# EAGLE design Gradiometric sensor (EAGLE 8.1.0)

## Sheet 1 of 2
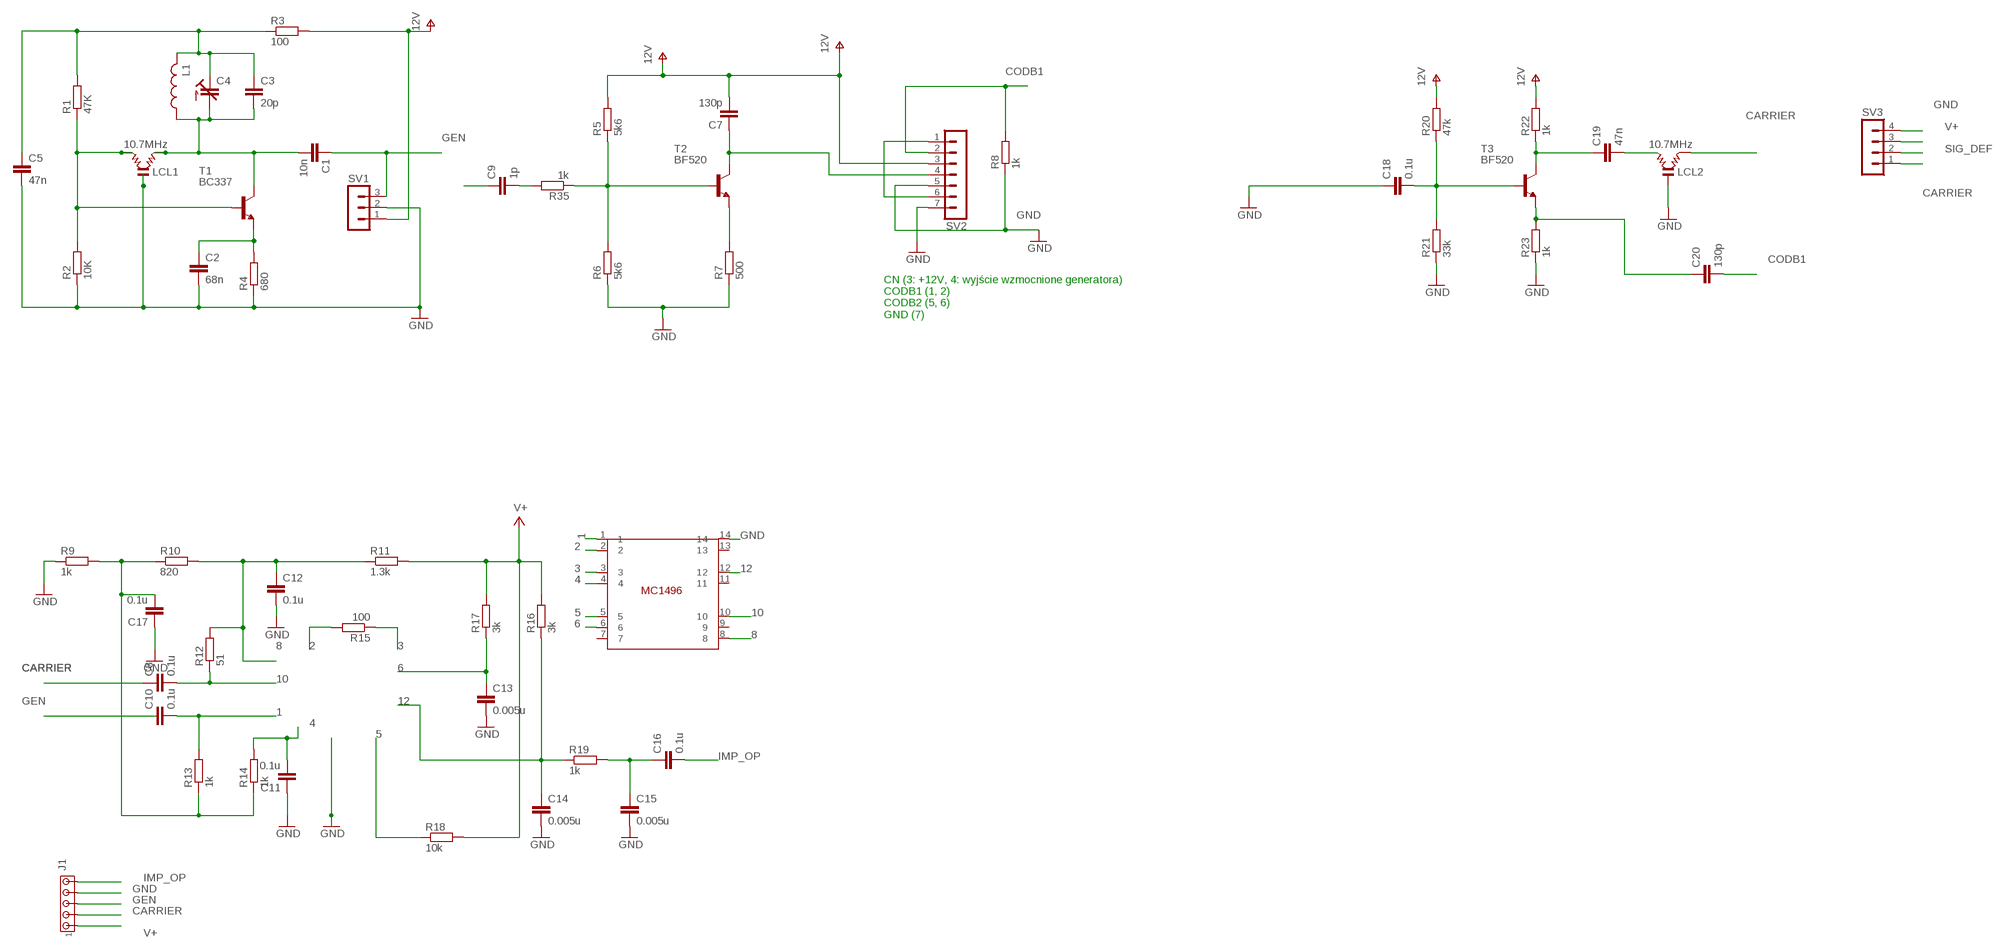
[diagram p0: schematic, sheet 1]

### Parts
C1  10n  C-EUC0805  [C0805]
C2  68n  C-EUC0805  [C0805]
C3  20p  C-EUC0805  [C0805]
C4  C-TRIMM808  [CTRIM808-BC]
C5  47n  C-EUC0805  [C0805]
C7  130p  C-EUC0805  [C0805]
C8  0.1u  C-EUC0805  [C0805]
C9  1p  C-EUC0805  [C0805]
C10  0.1u  C-EUC0805  [C0805]
C11  0.1u  C-EUC0805  [C0805]
C12  0.1u  C-EUC0805  [C0805]
C13  0.005u  C-EUC0805  [C0805]
C14  0.005u  C-EUC0805  [C0805]
C15  0.005u  C-EUC0805  [C0805]
C16  0.1u  C-EUC0805  [C0805]
C17  0.1u  C-EUC0805  [C0805]
C18  0.1u  C-EUC0805  [C0805]
C19  47n  C-EUC0805  [C0805]
C20  130p  C-EUC0805  [C0805]
J1  MTA05-100  [10X05MTA]
L1  L-USL1812  [L1812]
LCL1  10.7MHz  LCL  [LCL]
LCL2  10.7MHz  LCL  [LCL]
R1  47K  R-EU_R0805  [R0805]
R2  10K  R-EU_R0805  [R0805]
R3  100  R-EU_R0805  [R0805]
R4  680  R-EU_R0805  [R0805]
R5  5k6  R-EU_R0805  [R0805]
R6  5k6  R-EU_R0805  [R0805]
R7  500  R-EU_R0805  [R0805]
R8  1k  R-EU_R0805  [R0805]
R9  1k  R-EU_R0805  [R0805]
R10  820  R-EU_R0805  [R0805]
R11  1.3k  R-EU_R0805  [R0805]
R12  51  R-EU_R0805  [R0805]
R13  1k  R-EU_R0805  [R0805]
R14  1k  R-EU_R0805  [R0805]
R15  100  R-EU_R0805  [R0805]
R16  3k  R-EU_R0805  [R0805]
R17  3k  R-EU_R0805  [R0805]
R18  10k  R-EU_R0805  [R0805]
R19  1k  R-EU_R0805  [R0805]
R20  47k  R-EU_R0805  [R0805]
R21  33k  R-EU_R0805  [R0805]
R22  1k  R-EU_R0805  [R0805]
R23  1k  R-EU_R0805  [R0805]
R35  1k  R-EU_R0805  [R0805]
SV1  MA03-1  [MA03-1]
SV2  MA07-1  [MA07-1]
SV3  MA04-1  [MA04-1]
T1  BC337  [TO92]
T2  BF520  BC237  [TO92]
T3  BF520  BC237  [TO92]
U$1  MC1496  [SO-14DW]

### Nets
1: C10.2 R13.2 U$1.1
2: R15.2 U$1.2
3: R15.1 U$1.3
4: C11.2 R14.2 U$1.4
5: R18.1 U$1.5
6: C13.1 R17.1 U$1.6
8: C12.1 R10.2 R11.1 R12.2 U$1.8
10: C8.2 R12.1 U$1.10
12: C14.1 R16.1 R19.1 U$1.12
CARRIER: C8.1 J1.2 LCL2.2 SV3.1
CODB1: C20.2 R8.2 SV2.2
GEN: C1.1 C10.1 J1.3 SV1.3
GND: C2.2 C5.2 C11.1 C12.2 C13.2 C14.2 C15.2 C17.1 C18.1 J1.4 LCL1.0(GND) LCL2.0(GND) R2.1 R4.1 R6.1 R7.1 R8.1 R9.1 R21.1 R23.1 SV1.2 SV2.5 SV2.7 SV3.4 U$1.14 ; also sheet 2
IMP_OP: C16.2 J1.5 ; also sheet 2
N$1: C9.1
N$2: LCL1.1 R1.1 R2.2 T1.2(B)
N$3: C3.1 C4.1(E) C5.1 L1.2 R1.2 R3.1
N$4: C2.1 R4.2 T1.1(E)
N$5: R5.1 R6.2 R35.1 T2.2(B)
N$6: C1.2 C3.2 C4.2(A) L1.1 LCL1.2 T1.3(C)
N$7: R7.2 T2.1(E)
N$8: C7.1 SV2.4 T2.3(C)
N$9: SV2.1 SV2.6
N$10: C17.2 R9.2 R10.1 R13.1 R14.1
N$11: C15.1 C16.1 R19.2
N$12: C19.2 LCL2.1
N$13: C18.2 R20.1 R21.2 T3.2(B)
N$15: C19.1 R22.1 T3.3(C)
N$16: C20.1 R23.2 T3.1(E)
N$29: C9.2 R35.2
SIG_DEF: SV3.2 ; also sheet 2
V+: C7.2 J1.1 R3.2 R5.2 R11.2 R16.2 R17.2 R18.2 R20.2 R22.2 SV1.1 SV2.3 SV3.3 ; supply symbol labelled 12V ; also sheet 2
Unconnected: U$1.7 U$1.9 U$1.11 U$1.13

### Notes on the sheet
- CN (3: +12V, 4: wyjście wzmocnione generatora)
  CODB1 (1, 2)
  CODB2 (5, 6)
  GND (7)

## Sheet 2 of 2
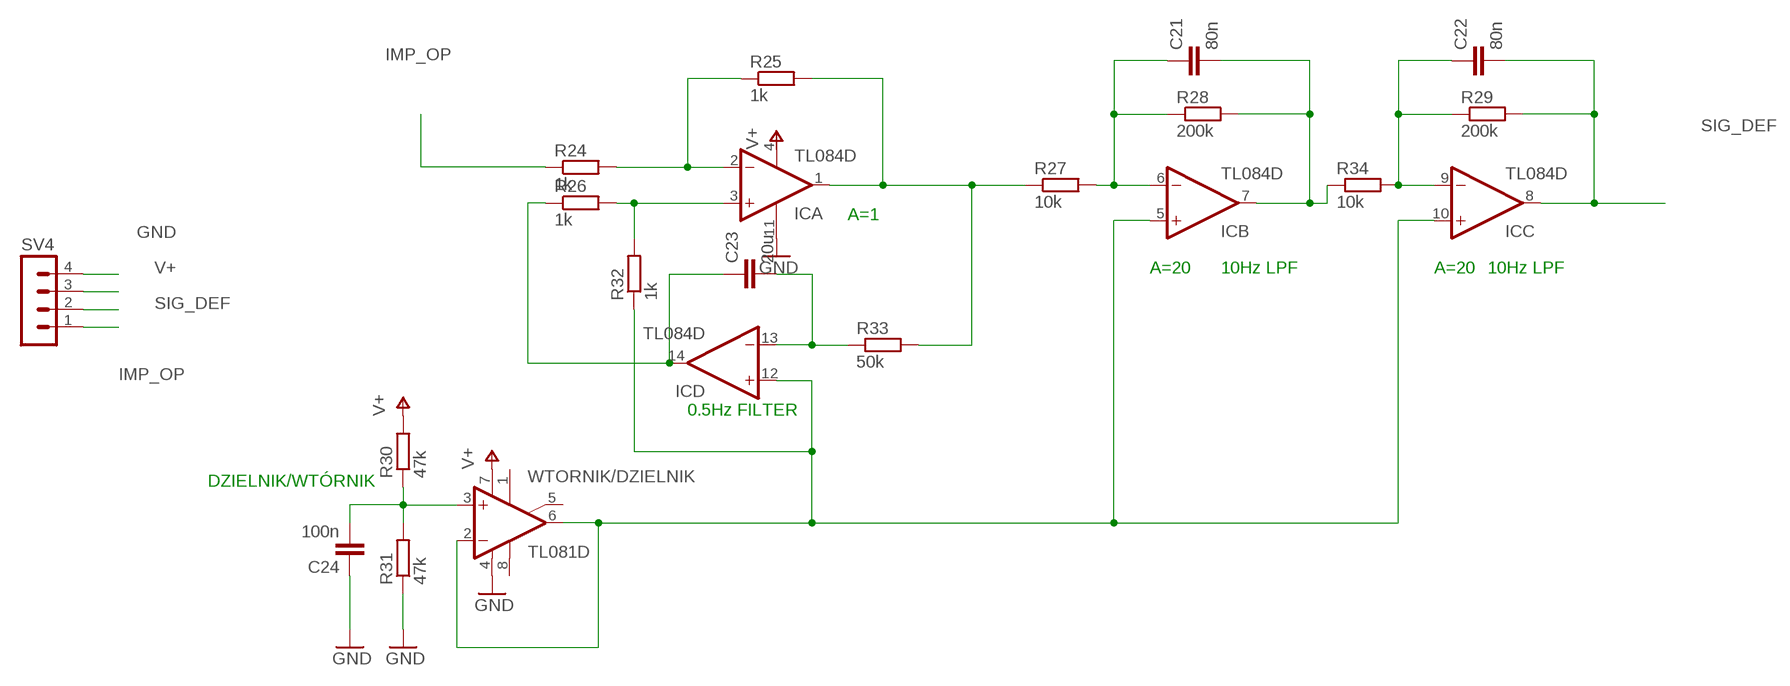
[diagram p1: schematic, sheet 2]

### Parts
C21  80n  C-EUC0805  [C0805]
C22  80n  C-EUC0805  [C0805]
C23  20u  C-EUC0805  [C0805]
C24  100n  C-EUC0805  [C0805]
IC  TL084D  [SO14]
R24  1k  R-EU_R0805  [R0805]
R25  1k  R-EU_R0805  [R0805]
R26  1k  R-EU_R0805  [R0805]
R27  10k  R-EU_R0805  [R0805]
R28  200k  R-EU_R0805  [R0805]
R29  200k  R-EU_R0805  [R0805]
R30  47k  R-EU_R0805  [R0805]
R31  47k  R-EU_R0805  [R0805]
R32  1k  R-EU_R0805  [R0805]
R33  50k  R-EU_R0805  [R0805]
R34  10k  R-EU_R0805  [R0805]
SV4  MA04-1  [MA04-1]
WTORNIK/DZIELNIK  TL081D  [SO08]

### Nets
GND: C24.1 IC.11(P:V-) R31.1 SV4.4 WTORNIK/DZIELNIK.4(V-) ; also sheet 1
IMP_OP: R24.1 SV4.1 ; also sheet 1
N$17: IC.2(A:-IN) R24.2 R25.1
N$18: IC.1(A:OUT) R25.2 R27.1 R33.2
N$19: IC.3(A:+IN) R26.2 R32.2
N$20: C23.1 IC.14(D:OUT) R26.1
N$21: C21.2 IC.7(B:OUT) R28.2 R34.1
N$22: C21.1 IC.6(B:-IN) R27.2 R28.1
N$23: IC.5(B:+IN) IC.10(C:+IN) IC.12(D:+IN) R32.1 WTORNIK/DZIELNIK.2(-IN) WTORNIK/DZIELNIK.6(OUT)
N$24: C23.2 IC.13(D:-IN) R33.1
N$25: C24.2 R30.1 R31.2 WTORNIK/DZIELNIK.3(+IN)
N$26: C22.1 IC.9(C:-IN) R29.1 R34.2
SIG_DEF: C22.2 IC.8(C:OUT) R29.2 SV4.2 ; also sheet 1
V+: R30.2 SV4.3 WTORNIK/DZIELNIK.7(V+) ; also sheet 1
Unconnected: WTORNIK/DZIELNIK.1(ON1) WTORNIK/DZIELNIK.5(ON2) WTORNIK/DZIELNIK.8(OPT)

### Notes on the sheet
- A=1
- A=20 | 10Hz LPF | A=20 | 10Hz LPF
- 0.5Hz FILTER
- DZIELNIK/WTÓRNIK

## Power pins joined to a net without a drawn wire
V+: IC.4(P:V+)

## Library data of the parts
C1-C3 C5 = resistor:C-EU: CAPACITOR, European symbol
C4 = rcl:C-TRIMM: Trimm capacitor
C7-C24 = rcl:C-EU: CAPACITOR, European symbol
IC = linear:TL084: OP AMP
J1 = con-amp:MTA05-100: AMP connector
L1 = rcl:L-US: INDUCTOR, American symbol
LCL1 LCL2 = murata-filter:LCL: FILTER; MPN: LCL; OC_FARNELL: 106331; OC_NEWARK: 06WX8509
R1-R4 = resistor:R-EU_: RESISTOR, European symbol
R5-R35 = rcl:R-EU_: RESISTOR, European symbol
SV1 = con-lstb:MA03-1: PIN HEADER; OC_FARNELL: unknown; OC_NEWARK: unknown
SV2 = con-lstb:MA07-1: PIN HEADER; OC_FARNELL: unknown; OC_NEWARK: unknown
SV3 SV4 = con-lstb:MA04-1: PIN HEADER; OC_FARNELL: unknown; OC_NEWARK: unknown
T1 = transistor:BC337: NPN TRANSISTOR
T2 T3 = transistor:BC237: NPN TRANSISTOR
U$1 = MC1496sch2:MC1496
WTORNIK/DZIELNIK = linear:TL081: OP AMP

## Board
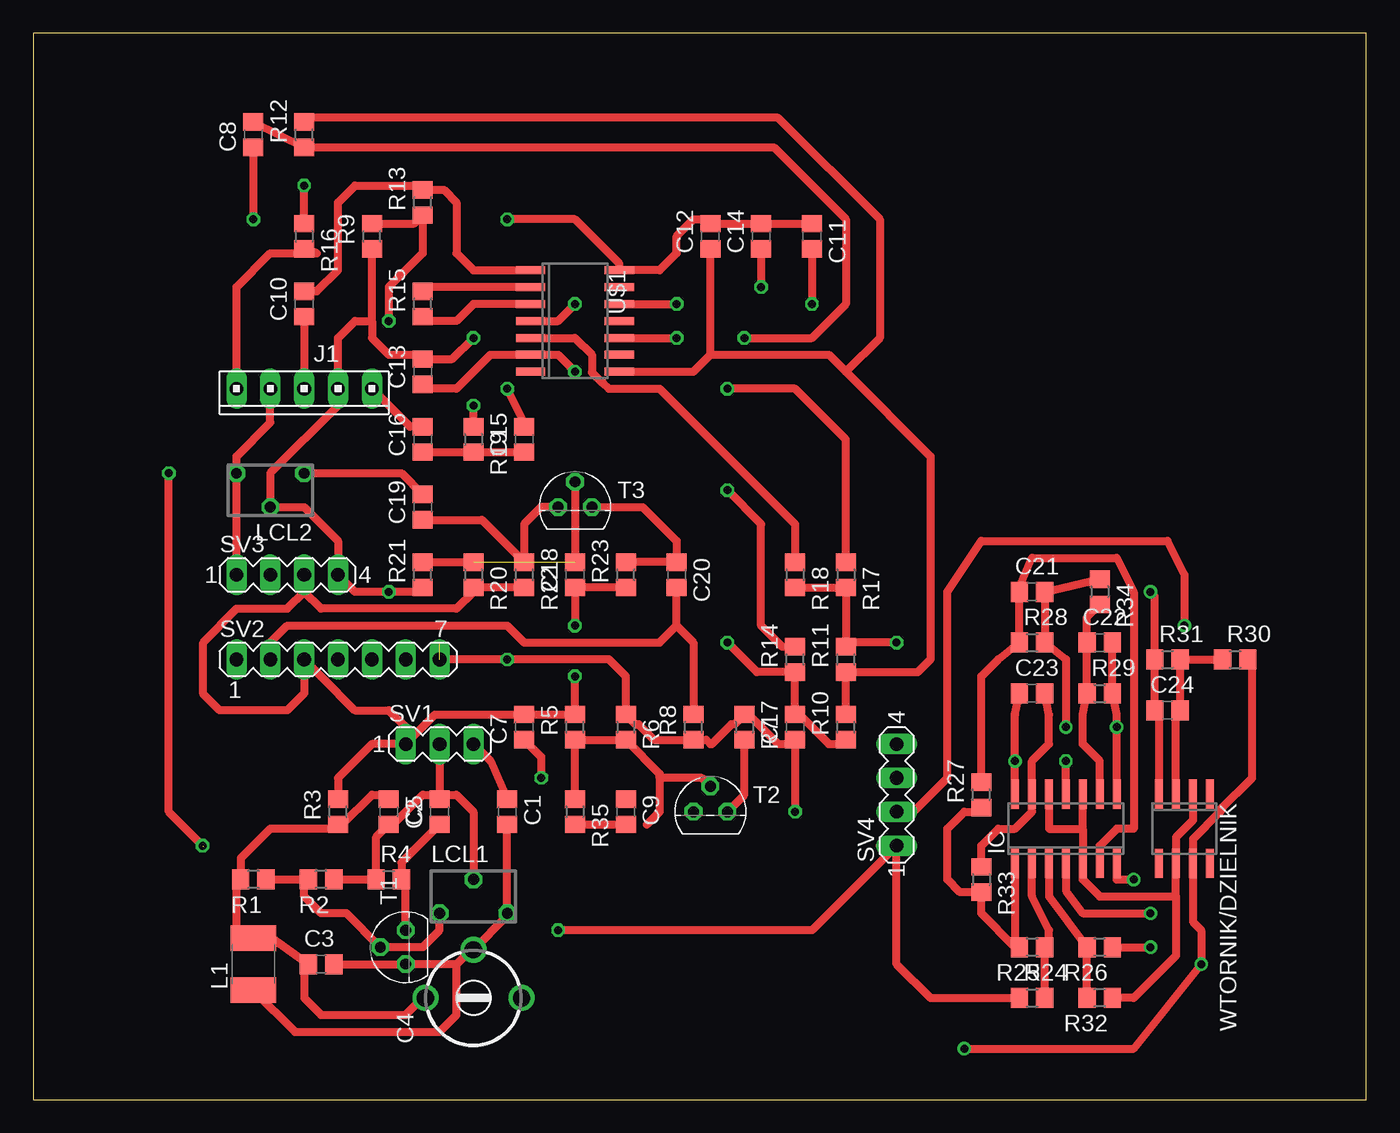
[diagram p2: board, top side]
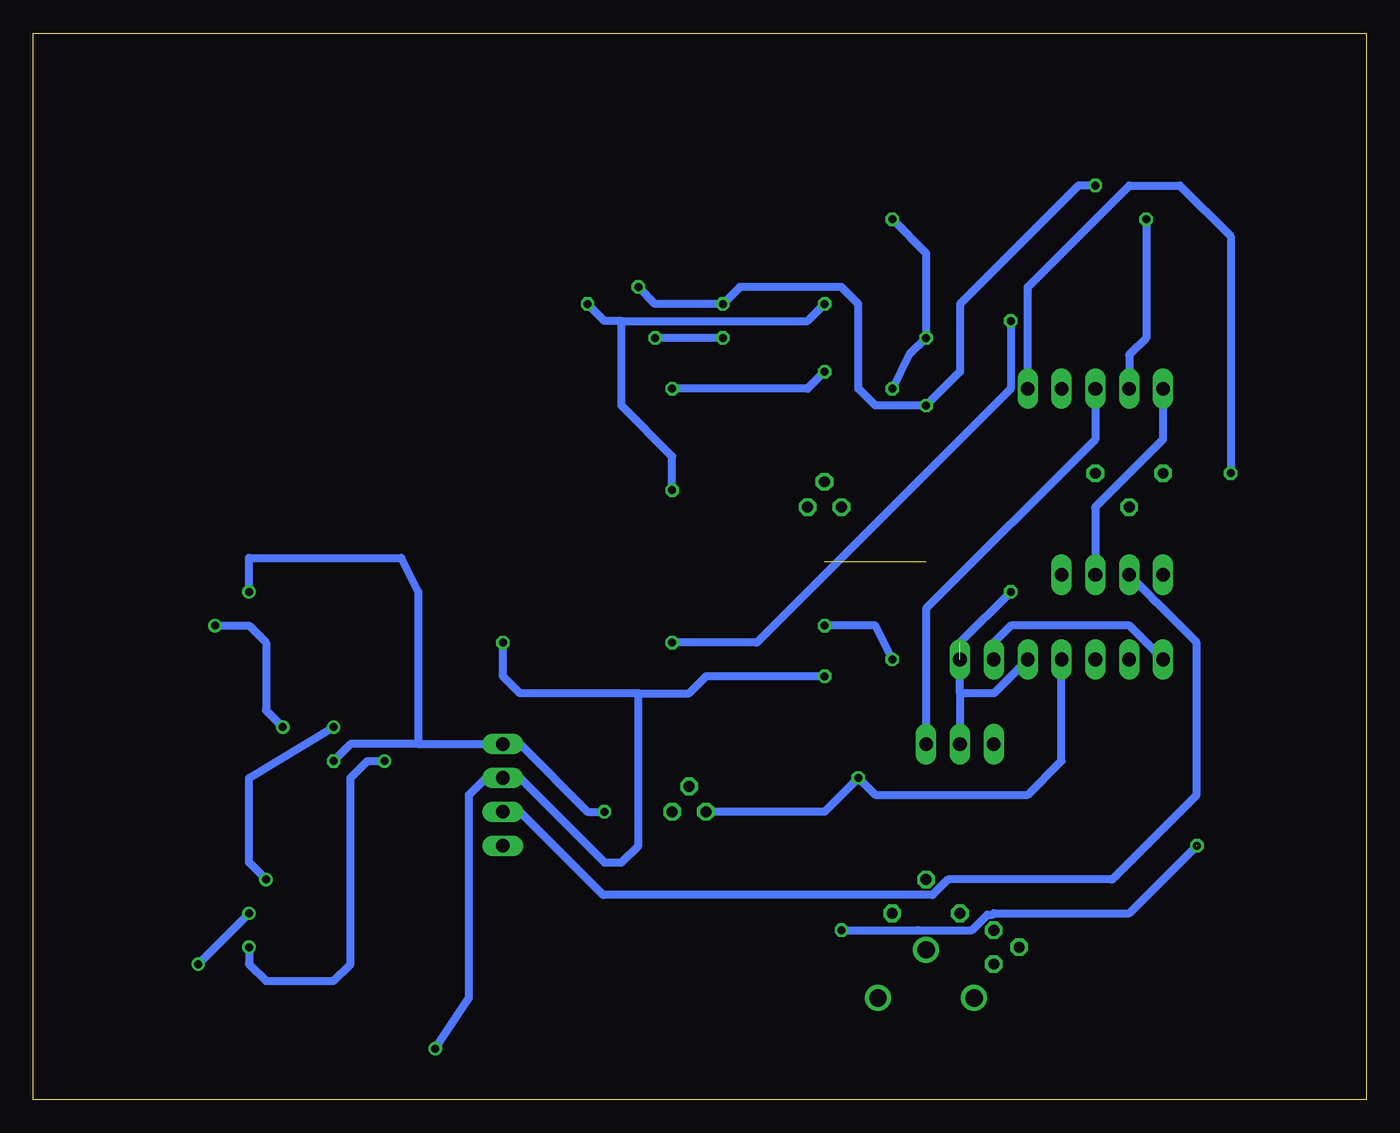
[diagram p3: board, bottom side, seen from below]

Size 100 x 80 mm. Coordinates in mm from the lower left corner, seen from the top.
Outline: 0,0 100,0 100,80 0,80 0,0
Copper layers (1*16): Top 0.035mm / dielectric 1.5mm / Bottom 0.035mm
Design rules "default": minimum track width 10mil, minimum drill 24mil, track to track 8mil, track to pad 8mil, pad to pad 8mil, via to via 8mil, smd to smd 8mil, copper to edge 40mil, drill to drill 8mil, minimum pad ring 10mil, minimum via ring 8mil, stop-mask expansion 4mil, vias tented up to drill 0mil, thermal gap 10mil

### Footprints (pad centres in the part's own frame; a part is rotated, then mirrored left to right if it is on the bottom)
C0805 = smd 1.3 x 1.5: 1 -0.95,0; 2 0.95,0
CTRIM808-BC = drill 1.3: 1 -3.607,0; 2 0,3.607; 3 3.607,0
SO14 = smd 0.6 x 2.2: 1 -3.81,-2.6; 2 -2.54,-2.6; 3 -1.27,-2.6; 4 0,-2.6; 5 1.27,-2.6; 6 2.54,-2.6; 7 3.81,-2.6; 8 3.81,2.6; 9 2.54,2.6; 10 1.27,2.6; 11 0,2.6; 12 -1.27,2.6; 13 -2.54,2.6; 14 -3.81,2.6
10X05MTA = drill 1.016 long: 1 5.08,0; 2 2.54,0; 3 0,0; 4 -2.54,0; 5 -5.08,0
L1812 = smd 1.9 x 3.4: 1 -1.95,0; 2 1.95,0
LCL = drill 0.813 octagon: 0 0,1.27; 1 -2.54,-1.27; 2 2.54,-1.27
R0805 = smd 1.3 x 1.5: 1 -0.95,0; 2 0.95,0
MA03-1 = drill 1.016 long: 1 -2.54,0; 2 0,0; 3 2.54,0
MA07-1 = drill 1.016 long: 1 -7.62,0; 2 -5.08,0; 3 -2.54,0; 4 0,0; 5 2.54,0; 6 5.08,0; 7 7.62,0
MA04-1 = drill 1.016 long: 1 -3.81,0; 2 -1.27,0; 3 1.27,0; 4 3.81,0
TO92 = drill 0.813 octagon: 1 1.27,0; 2 0,1.905; 3 -1.27,0
SO-14DW = smd 0.6 x 2.2: 1 -3.81,-4.6; 2 -2.54,-4.6; 3 -1.27,-4.6; 4 0,-4.6; 5 1.27,-4.6; 6 2.54,-4.6; 7 3.81,-4.6; 8 3.81,2.06; 9 2.54,2.06; 10 1.27,2.06; 11 0,2.06; 12 -1.27,2.06; 13 -2.54,2.06; 14 -3.81,2.06
SO08 = smd 0.6 x 2.2: 1 -1.905,-2.6; 2 -0.635,-2.6; 3 0.635,-2.6; 4 1.905,-2.6; 5 1.905,2.6; 6 0.635,2.6; 7 -0.635,2.6; 8 -1.905,2.6

### Placement (x,y rotation side)
C1  35.56,21.59 270 top
C2  30.48,21.59 90 top
C3  21.59,10.16 0 top
C4  33.02,7.62 0 top
C5  26.67,21.59 270 top
C7  36.83,27.94 90 top
C8  16.51,72.39 90 top
C9  44.45,21.59 270 top
C10  20.32,59.69 90 top
C11  58.42,64.77 270 top
C12  50.8,64.77 90 top
C13  29.21,54.61 90 top
C14  54.61,64.77 90 top
C15  36.83,49.53 90 top
C16  29.21,49.53 90 top
C17  57.15,27.94 90 top
C18  40.64,39.37 90 top
C19  29.21,44.45 90 top
C20  48.26,39.37 270 top
C21  74.93,38.1 0 top
C22  80.01,34.29 0 top
C23  74.93,30.48 0 top
C24  85.09,29.21 0 top
IC  77.47,20.32 0 top
J1  20.32,53.34 180 top
L1  16.51,10.16 90 top
LCL1  33.02,15.24 0 top
LCL2  17.78,45.72 180 top
R1  16.51,16.51 180 top
R2  21.59,16.51 180 top
R3  22.86,21.59 90 top
R4  26.67,16.51 0 top
R5  40.64,27.94 90 top
R6  44.45,27.94 270 top
R7  53.34,27.94 270 top
R8  49.53,27.94 90 top
R9  25.4,64.77 90 top
R10  60.96,27.94 90 top
R11  60.96,33.02 90 top
R12  20.32,72.39 90 top
R13  29.21,67.31 90 top
R14  57.15,33.02 90 top
R15  29.21,59.69 90 top
R16  20.32,64.77 270 top
R17  60.96,39.37 270 top
R18  57.15,39.37 270 top
R19  33.02,49.53 270 top
R20  33.02,39.37 270 top
R21  29.21,39.37 90 top
R22  36.83,39.37 270 top
R23  44.45,39.37 90 top
R24  74.93,7.62 0 top
R25  74.93,11.43 180 top
R26  80.01,11.43 180 top
R27  71.12,22.86 90 top
R28  74.93,34.29 0 top
R29  80.01,30.48 0 top
R30  90.17,33.02 0 top
R31  85.09,33.02 0 top
R32  80.01,7.62 180 top
R33  71.12,16.51 270 top
R34  80.01,38.1 270 top
R35  40.64,21.59 270 top
SV1  30.48,26.67 0 top
SV2  22.86,33.02 0 top
SV3  19.05,39.37 0 top
SV4  64.77,22.86 90 top
T1  27.94,11.43 90 top
T2  50.8,21.59 0 top
T3  40.64,44.45 0 top
U$1  41.91,58.42 270 top
WTORNIK/DZIELNIK  86.36,20.32 180 top

### Tracks (layer width: path | path; a pad name or v marks a point on that pad's centre or on a via)
1
  Top 0.61: U$1.1 33.02,62.23 31.75,63.5 31.75,67.31 30.8,68.26 R13.2 28.89,68.58 24.13,68.58 22.86,67.31 22.86,62.23 21.27,60.64 C10.2
2
  Top 0.61: U$1.2 29.53,60.96 R15.2
3
  Top 0.61: U$1.3 33.02,59.69 31.75,58.42 29.53,58.42 R15.1
4  (via drill 0.6)
  Top 0.61: U$1.4 39.37,58.42 v40.64,59.69 | C11.2 v58.42,59.69 | R14.2 56.2,33.97 54.61,35.56 54.61,43.18 v52.07,45.72
  Bottom 0.61: v40.64,59.69 41.91,58.42 55.88,58.42 | 55.88,58.42 57.15,58.42 v58.42,59.69 | v52.07,45.72 52.07,48.26 55.88,52.07 55.88,58.42
5
  Top 0.61: U$1.5 40.64,57.15 41.91,55.88 41.91,54.55 42.66,53.8 42.72,53.8 43.18,53.34 46.99,53.34 57.15,43.18 R18.1
6  (via drill 0.6)
  Top 0.61: C13.1 29.53,53.34 31.75,53.34 34.29,55.88 U$1.6 39.37,55.88 v40.64,54.61 | R17.1 60.96,49.53 57.15,53.34 v52.07,53.34
  Bottom 0.61: v40.64,54.61 41.91,53.34 v52.07,53.34
8
  Top 0.61: R10.2 R11.1 66.36,32.07 67.31,33.02 67.31,48.26 60.96,54.61 | U$1.8 49.53,54.61 50.8,55.88 | 50.8,55.88 C12.1 | 50.8,55.88 59.69,55.88 60.96,54.61 | R12.2 20.64,73.66 55.88,73.66 63.5,66.04 63.5,57.15 60.96,54.61
10  (via drill 0.6)
  Top 0.61: C8.2 R12.1 55.56,71.44 60.96,66.04 60.96,59.69 58.42,57.15 v53.34,57.15 | U$1.10 v48.26,57.15
  Bottom 0.61: v48.26,57.15 v53.34,57.15
12  (via drill 0.6)
  Top 0.61: R16.1 v20.32,68.58 | R19.1 v33.02,52.07 | C14.1 v54.61,60.96 | U$1.12 v48.26,59.69
  Bottom 0.61: v20.32,68.58 21.59,68.58 30.48,59.69 30.48,54.61 v33.02,52.07 36.83,52.07 38.1,53.34 38.1,59.69 39.37,60.96 46.99,60.96 v48.26,59.69 53.34,59.69 v54.61,60.96
CARRIER  (via drill 0.6)
  Top 0.61: SV3.1 LCL2.2 15.24,48.26 17.78,50.8 J1.2 | C8.1 v16.51,66.04
  Bottom 0.61: v16.51,66.04 16.51,57.15 17.78,55.88 J1.2
CODB1
  Top 0.61: SV2.2 17.78,34.29 19.05,35.56 35.56,35.56 36.83,34.29 46.99,34.29 48.26,35.56 | 48.26,35.56 C20.2 | 48.26,35.56 49.53,34.29 R8.2
GEN
  Top 0.61: SV1.3 34.29,25.4 C1.1 | C10.1 J1.3
  Bottom 0.61: J1.3 20.32,49.53 33.02,36.83 SV1.3
GND  (via drill 0.6)  (1 unrouted)
  Top 0.61: C2.2 30.16,22.86 29.21,22.86 26.99,20.64 C5.2 25.72,19.69 R4.1 R2.1 | SV1.2 C2.2 | C2.2 30.8,22.86 31.75,22.86 33.02,21.59 LCL1.0 | SV2.7 v35.56,33.02 43.18,33.02 44.45,31.75 R6.1 45.19,28.15 45.41,28.15 46.57,26.99 R8.1 50.48,26.99 50.8,26.67 50.9,26.67 52.38,28.15 52.6,28.15 R7.1 53.66,28.89 55.88,26.67 56.83,26.67 C17.1 v57.15,21.59 | R23.1 C18.1 v40.64,35.56 | R21.1 29.21,38.1 v26.67,38.1 24.13,38.1 SV3.4 22.86,41.91 20.32,44.45 LCL2.0 17.78,46.99 22.86,52.07 J1.4 22.86,57.15 24.13,58.42 25.4,58.42 | 25.4,58.42 R9.1 | 25.4,58.42 25.4,57.15 26.67,55.88 28.89,55.88 C13.2 31.43,55.56 v33.02,57.15 | C11.1 C14.2 C12.2 50.48,66.04 49.53,66.04 48.26,64.77 48.26,63.5 46.99,62.23 U$1.14 43.97,62.71 40.64,66.04 v35.56,66.04 | C15.2 36.83,50.8 v35.56,53.34 | WTORNIK/DZIELNIK.4 84.45,28.89 C24.1 R31.1 84.14,37.78 v83.82,38.1 | IC.11 v77.47,25.4
  Bottom 0.61: 30.48,30.48 SV2.7 | 30.48,30.48 SV1.2 | SV2.5 26.67,31.75 26.67,31.73 27.92,30.48 30.48,30.48 | v26.67,38.1 30.48,34.29 | v35.56,33.02 36.83,35.56 v40.64,35.56 | v35.56,53.34 34.29,55.88 v33.02,57.15 33.02,63.5 v35.56,66.04 | v77.47,25.4 76.2,26.67 71.12,26.67 | 71.12,26.67 SV4.4 63.5,26.67 58.42,21.59 v57.15,21.59 | v83.82,38.1 83.82,40.64 72.39,40.64 71.12,38.1 71.12,26.67
IMP_OP  (via drill 0.6)  (1 unrouted)
  Top 0.61: C16.2 28.26,50.48 J1.5 | SV4.1 64.77,10.16 67.31,7.62 R24.1 | SV4.1 63.5,19.05 | SV4.1 58.42,12.7 v39.37,12.7 | v12.7,19.05 10.16,21.59 v10.16,46.99
  Bottom 0.61: v39.37,12.7 33.64,12.7 33.63,12.71 29.58,12.71 28.42,13.87 28.04,13.87 27.94,13.97 17.78,13.97 12.75,19 | J1.5 25.4,60.96 17.78,68.58 13.97,68.58 10.16,64.77 v10.16,46.99
N$2
  Top 0.61: R1.1 R2.2 20.32,16.19 20.32,15.24 21.59,13.97 23.5,13.97 T1.2 29.21,11.43 30.48,12.7 LCL1.1
N$3
  Top 0.61: C5.1 26.35,22.86 25.4,22.86 23.18,20.64 R3.1 22.54,20.32 17.78,20.32 15.56,18.1 R1.2 15.24,16.19 15.24,12.7 | 15.24,12.7 15.24,11.43 | C4.1 29.21,7.62 27.94,6.35 21.59,6.35 20.32,7.62 20.32,9.84 C3.1 17.1,12.7 L1.2 15.92,12.7 15.24,12.7
N$4
  Top 0.61: C2.1 27.62,17.78 R4.2 27.94,16.19 T1.1
N$5
  Top 0.61: 46.04,20.64 46.99,21.59 46.99,24.13 | 46.99,24.13 46.99,24.45 R6.2 R5.1 R35.1 | T2.2 50.16,24.13 46.99,24.13
N$6
  Top 0.61: C1.2 LCL1.2 35.56,13.77 C4.2 32.82,11.23 31.75,10.16 | C3.2 T1.3 31.75,10.16 | L1.1 19.64,5.08 30.48,5.08 31.75,6.35 31.75,10.16
N$7
  Top 0.61: T2.1 53.34,22.86 R7.2
N$8  (via drill 0.6)
  Top 0.61: v38.1,24.13 38.1,25.72 C7.1
  Bottom 0.61: T2.3 40.64,21.59 v38.1,24.13 36.83,22.86 25.4,22.86 22.86,25.4 SV2.4
N$9
  Bottom 0.61: SV2.1 16.51,34.29 16.51,34.31 17.76,35.56 26.67,35.56 27.94,34.29 SV2.6
N$10  (via drill 0.6)
  Top 0.61: R10.1 60.64,26.67 59.69,26.67 57.47,28.89 C17.2 R14.1 54.29,32.07 v52.07,34.29 | R9.2 28.57,65.72 R13.1 29.21,63.5 26.67,60.96 v26.67,58.42
  Bottom 0.61: v26.67,58.42 26.67,53.34 45.72,34.29 v52.07,34.29
N$11
  Top 0.61: C16.1 R19.2 C15.1
N$12
  Top 0.61: LCL2.1 27.62,46.99 C19.2
N$13  (1 unrouted)
  Top 0.61: T3.2 C18.2 | R21.2 R20.1
N$15
  Top 0.61: C19.1 33.65,43.5 R22.1 36.83,43.18 38.1,44.45 T3.3
N$16
  Top 0.61: T3.1 45.72,44.45 48.26,41.91 C20.1 R23.2
N$17
  Top 0.61: R24.2 R25.1 arc90 76.2,11.75 76.2,12.7 74.93,15.24 IC.2
N$18
  Top 0.61: IC.1 73.66,11.75 R25.2 73.66,11.43 71.12,13.97 R33.2 69.53,15.56 68.58,16.51 68.58,20.32 69.85,21.59 70.8,21.59 R27.1
N$19
  Top 0.61: IC.3 76.2,15.24 R26.2 R32.2
N$20  (via drill 0.6)
  Top 0.61: IC.14 v73.66,25.4 73.66,28.89 C23.1 | R26.1 v83.82,11.43
  Bottom 0.61: v83.82,11.43 83.82,10.16 82.55,8.89 77.47,8.89 76.2,10.16 76.2,24.13 74.93,25.4 v73.66,25.4
N$21  (via drill 0.6)
  Top 0.61: R34.1 C21.2 R28.2 77.47,33.02 v77.47,27.94 | IC.7 81.28,16.51 v82.55,16.51
  Bottom 0.61: v82.55,16.51 83.82,17.78 83.82,24.13 v77.47,27.94
N$22
  Top 0.61: IC.6 80.01,19.05 81.28,20.32 82.55,20.32 82.55,38.1 81.28,40.64 74.93,40.64 73.98,38.42 C21.1 R28.1 72.39,33.02 71.12,31.75 R27.2
N$23
  Top 0.61: WTORNIK/DZIELNIK.2 87,20.95 85.72,19.68 WTORNIK/DZIELNIK.6 85.72,15.24 | IC.12 76.2,20.32 78.74,20.32 | 78.74,20.32 IC.10 | 78.74,20.32 IC.5 78.74,16.51 80.01,15.24 85.72,15.24 | R32.1 82.55,7.62 85.72,10.79 85.72,15.24
N$24
  Top 0.61: C23.2 76.2,28.89 76.2,26.67 74.93,25.4 IC.13 74.93,21.59 73.66,20.32 72.39,20.32 71.12,19.05 R33.1
N$25
  Top 0.61: R30.1 R31.2 C24.2 85.72,28.89 WTORNIK/DZIELNIK.3
N$26
  Top 0.61: IC.9 80.01,25.4 78.74,26.67 78.74,28.89 R29.1 C22.1 79.06,36.2 R34.2
N$29
  Top 0.61: R35.2 C9.2
SIG_DEF  (via drill 0.6)
  Top 0.61: C22.2 R29.2 81.28,28.89 v81.28,27.94 IC.8 | v86.36,35.56 86.36,39.37 85.09,41.91 71.12,41.91 68.58,38.1 68.58,24.13 66.04,21.59 SV4.2
  Bottom 0.61: v86.36,35.56 83.82,35.56 82.55,34.29 82.55,29.21 v81.28,27.94 | SV3.2 16.51,38.1 16.51,38.08 15.77,37.34 15.75,37.34 12.75,34.34 12.75,22.81 19.05,16.51 31.37,16.51 32.54,15.34 57.25,15.34 63.5,21.59 SV4.2
V+  (via drill 0.6)
  Top 0.61: SV1.1 25.4,26.67 22.86,24.13 R3.2 | SV1.1 29.21,27.94 29.21,27.96 30.14,28.89 C7.2 R5.2 v40.64,31.75 | SV1.1 27.94,27.94 26.67,29.21 24.11,29.21 21.59,31.73 21.59,31.75 SV2.3 20.32,30.48 19.05,29.21 13.97,29.21 12.75,30.43 12.75,34.29 15.24,36.83 19.05,36.83 20.32,38.1 | 20.32,38.1 SV3.3 | R22.2 R20.2 33.02,38.1 31.75,36.83 21.59,36.83 20.32,38.1 | J1.1 15.24,60.96 17.78,63.5 21.27,63.5 R16.2 | v64.77,34.29 61.28,34.29 R11.2 R17.2 R18.2 | R30.2 91.44,32.7 91.44,24.13 89.07,21.76 89.07,21.61 87,19.53 WTORNIK/DZIELNIK.7 87,13.34 87.63,12.7 v87.63,10.16 82.55,3.81 v69.85,3.81 | IC.4 77.47,15.66 78.74,13.97 v83.82,13.97
  Bottom 0.61: J1.1 15.24,49.53 20.32,44.45 SV3.3 | v40.64,31.75 49.53,31.75 50.8,30.48 54.61,30.48 | 54.61,30.48 63.5,30.48 64.77,31.75 v64.77,34.29 | v69.85,3.81 67.31,7.62 67.31,22.86 66.04,24.13 SV4.3 63.5,24.13 57.15,17.78 55.88,17.78 54.61,19.05 54.61,30.48 | v83.82,13.97 v87.63,10.16